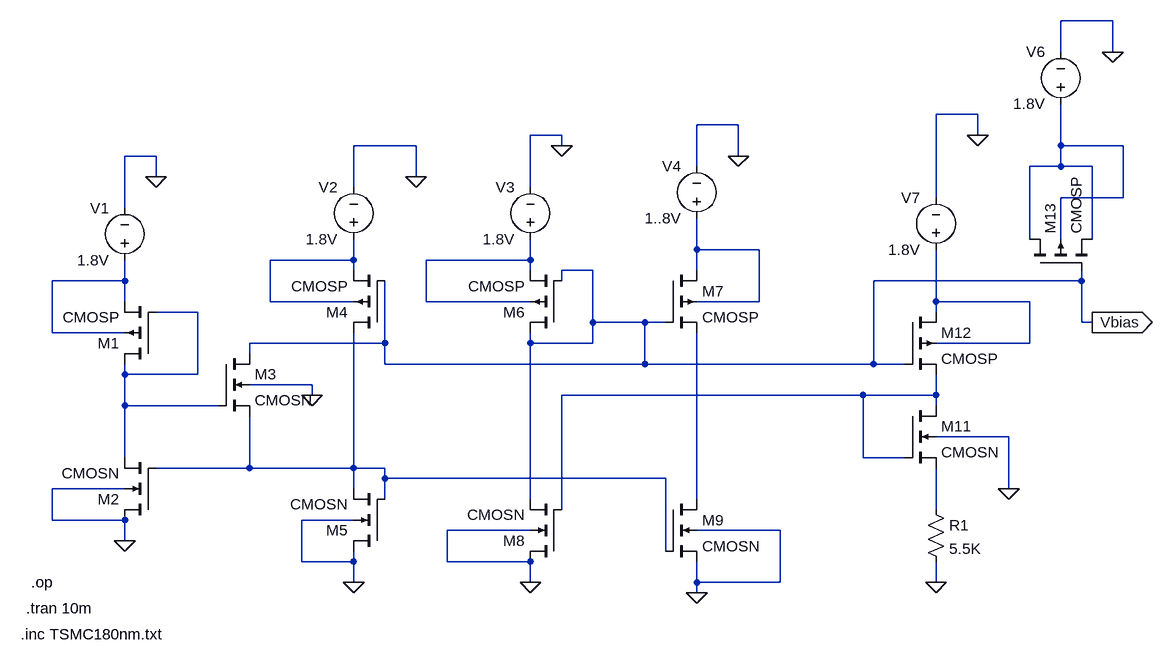
[diagram p0: schematic 1st.asc]
1st.asc, the LTspice schematic file:
Version 4
SHEET 1 1484 680
WIRE 1392 -416 1312 -416
WIRE 1312 -368 1312 -416
WIRE 1392 -368 1392 -416
WIRE 1184 -272 1120 -272
WIRE 816 -256 752 -256
WIRE 544 -240 496 -240
WIRE 1184 -240 1184 -272
WIRE 320 -224 224 -224
WIRE 544 -224 544 -240
WIRE 1312 -224 1312 -288
WIRE 1408 -224 1312 -224
WIRE -80 -208 -128 -208
WIRE 816 -208 816 -256
WIRE 752 -192 752 -256
WIRE 1312 -192 1312 -224
WIRE 1312 -192 1264 -192
WIRE 1360 -192 1312 -192
WIRE -80 -176 -80 -208
WIRE 320 -176 320 -224
WIRE 224 -160 224 -224
WIRE 496 -160 496 -240
WIRE 1120 -144 1120 -272
WIRE 1408 -144 1408 -224
WIRE 1408 -144 1312 -144
WIRE -128 -128 -128 -208
WIRE 1264 -80 1264 -192
WIRE 1312 -80 1312 -144
WIRE 1360 -80 1360 -192
WIRE 752 -64 752 -112
WIRE 848 -64 752 -64
WIRE 224 -48 224 -80
WIRE 224 -48 96 -48
WIRE 496 -48 496 -80
WIRE 496 -48 336 -48
WIRE 224 -32 224 -48
WIRE 496 -32 496 -48
WIRE 592 -32 544 -32
WIRE 752 -32 752 -64
WIRE -128 -16 -128 -48
WIRE -128 -16 -240 -16
WIRE 544 -16 544 -32
WIRE 1344 -16 1344 -32
WIRE 1344 -16 1024 -16
WIRE -128 16 -128 -16
WIRE 96 16 96 -48
WIRE 224 16 96 16
WIRE 336 16 336 -48
WIRE 496 16 336 16
WIRE 848 16 848 -64
WIRE 848 16 752 16
WIRE 1120 16 1120 -64
WIRE 1264 16 1120 16
WIRE -16 32 -80 32
WIRE 1120 32 1120 16
WIRE 592 48 592 -32
WIRE 672 48 592 48
WIRE 704 48 672 48
WIRE 1344 48 1344 -16
WIRE 1360 48 1344 48
WIRE -240 64 -240 -16
WIRE -128 64 -240 64
WIRE 272 80 272 -16
WIRE 272 80 64 80
WIRE 496 80 496 64
WIRE 592 80 592 48
WIRE 592 80 496 80
WIRE 1264 80 1264 16
WIRE 1264 80 1120 80
WIRE 64 96 64 80
WIRE 272 112 272 80
WIRE 672 112 672 48
WIRE 672 112 272 112
WIRE 1024 112 1024 -16
WIRE 1024 112 672 112
WIRE 1072 112 1024 112
WIRE -128 128 -128 112
WIRE -16 128 -16 32
WIRE -16 128 -128 128
WIRE 160 144 64 144
WIRE 160 160 160 144
WIRE 1008 160 544 160
WIRE 1120 160 1120 128
WIRE 1120 160 1008 160
WIRE -128 176 -128 128
WIRE 16 176 -128 176
WIRE 1120 176 1120 160
WIRE 1232 224 1120 224
WIRE -128 256 -128 176
WIRE 1008 256 1008 160
WIRE 1072 256 1008 256
WIRE 64 272 64 192
WIRE 64 272 -80 272
WIRE 224 272 224 64
WIRE 224 272 64 272
WIRE 272 272 224 272
WIRE 272 288 272 272
WIRE 704 288 272 288
WIRE -128 304 -240 304
WIRE 224 304 224 272
WIRE 1232 304 1232 224
WIRE 272 320 272 288
WIRE 496 320 496 80
WIRE 752 320 752 64
WIRE 544 336 544 160
WIRE 1120 336 1120 272
WIRE -240 352 -240 304
WIRE -128 352 -240 352
WIRE 224 352 144 352
WIRE 496 368 368 368
WIRE 880 368 752 368
WIRE -128 384 -128 352
WIRE 704 400 704 288
WIRE 144 416 144 352
WIRE 224 416 224 400
WIRE 224 416 144 416
WIRE 368 416 368 368
WIRE 496 416 368 416
WIRE 224 448 224 416
WIRE 496 448 496 416
WIRE 752 448 752 416
WIRE 880 448 880 368
WIRE 880 448 752 448
WIRE 1120 448 1120 416
WIRE 752 464 752 448
FLAG -80 -176 0
FLAG -128 384 0
FLAG 320 -176 0
FLAG 544 -224 0
FLAG 224 448 0
FLAG 496 448 0
FLAG 752 464 0
FLAG 1184 -240 0
FLAG 1392 -368 0
FLAG 1120 448 0
FLAG 816 -208 0
FLAG 1360 48 Vbias
IOPIN 1360 48 Out
FLAG 160 160 0
FLAG 1232 304 0
SYMBOL voltage -128 -32 R180
WINDOW 0 24 96 Left 2
WINDOW 3 24 16 Left 2
WINDOW 123 0 0 Left 0
WINDOW 39 0 0 Left 0
SYMATTR InstName V1
SYMATTR Value 1.8V
SYMBOL pmos4 -80 112 R180
SYMATTR InstName M1
SYMATTR Value2 l=1800n w=900n
SYMATTR Value CMOSP
SYMBOL nmos4 -80 352 R180
SYMATTR InstName M2
SYMATTR Value2 l=360n w=1800n
SYMATTR Value CMOSN
SYMBOL nmos4 16 96 R0
SYMATTR InstName M3
SYMATTR Value2 l=360n w=720n
SYMATTR Value CMOSN
SYMBOL pmos4 272 64 R180
SYMATTR InstName M4
SYMATTR Value2 l=360n w=4320n
SYMATTR Value CMOSP
SYMBOL voltage 224 -64 R180
WINDOW 0 24 96 Left 2
WINDOW 3 24 16 Left 2
WINDOW 123 0 0 Left 0
WINDOW 39 0 0 Left 0
SYMATTR InstName V2
SYMATTR Value 1.8V
SYMBOL nmos4 272 400 R180
SYMATTR InstName M5
SYMATTR Value2 l=360n w=1800n
SYMATTR Value CMOSN
SYMBOL pmos4 544 64 R180
SYMATTR InstName M6
SYMATTR Value2 l=360n w=4320n
SYMATTR Value CMOSP
SYMBOL pmos4 704 -32 R0
SYMATTR InstName M7
SYMATTR Value2 l=360n w=4320n
SYMATTR Value CMOSP
SYMBOL voltage 496 -64 R180
WINDOW 0 24 96 Left 2
WINDOW 3 24 16 Left 2
WINDOW 123 0 0 Left 0
WINDOW 39 0 0 Left 0
SYMATTR InstName V3
SYMATTR Value 1.8V
SYMBOL nmos4 544 416 R180
SYMATTR InstName M8
SYMATTR Value2 l=360n w=1800n
SYMATTR Value CMOSN
SYMBOL nmos4 704 320 R0
SYMATTR InstName M9
SYMATTR Value2 l=360n w=1800n
SYMATTR Value CMOSN
SYMBOL nmos4 1072 176 R0
SYMATTR InstName M11
SYMATTR Value2 l=360n w=5400n
SYMATTR Value CMOSN
SYMBOL pmos4 1072 32 R0
SYMATTR InstName M12
SYMATTR Value2 l=360n w=4320n
SYMATTR Value CMOSP
SYMBOL pmos4 1264 -32 R270
SYMATTR InstName M13
SYMATTR Value2 l=9000n w=9000n
SYMATTR Value CMOSP
SYMBOL voltage 1312 -272 R180
WINDOW 0 24 96 Left 2
WINDOW 3 24 16 Left 2
WINDOW 123 0 0 Left 0
WINDOW 39 0 0 Left 0
SYMATTR InstName V6
SYMATTR Value 1.8V
SYMBOL voltage 1120 -48 R180
WINDOW 0 24 96 Left 2
WINDOW 3 24 16 Left 2
WINDOW 123 0 0 Left 0
WINDOW 39 0 0 Left 0
SYMATTR InstName V7
SYMATTR Value 1.8V
SYMBOL res 1104 320 R0
SYMATTR InstName R1
SYMATTR Value 5.5K
SYMBOL voltage 752 -96 R180
WINDOW 0 24 96 Left 2
WINDOW 3 24 16 Left 2
WINDOW 123 0 0 Left 0
WINDOW 39 0 0 Left 0
SYMATTR InstName V4
SYMATTR Value 1..8V
TEXT -280 488 Left 2 !.tran 10m
TEXT -288 528 Left 2 !.inc TSMC180nm.txt
TEXT -272 448 Left 2 !.op

The netlist it stands for:
* 1st.asc
V1 N005 0 1.8V
M1 N007 N007 N005 N005 CMOSP l=1800n w=900n
M2 0 N009 N007 0 CMOSN l=360n w=1800n
M3 Vbias N007 N009 0 CMOSN l=360n w=720n
M4 N009 Vbias N003 N003 CMOSP l=360n w=4320n
V2 N003 0 1.8V
M5 0 N009 N009 0 CMOSN l=360n w=1800n
M6 Vbias Vbias N004 N004 CMOSP l=360n w=4320n
M7 N002 Vbias N010 N002 CMOSP l=360n w=4320n
V3 N004 0 1.8V
M8 0 N008 Vbias 0 CMOSN l=360n w=1800n
M9 N010 N009 0 0 CMOSN l=360n w=1800n
M11 N008 N008 N011 0 CMOSN l=360n w=5400n
M12 N006 Vbias N008 N006 CMOSP l=360n w=4320n
M13 N001 Vbias N001 N001 CMOSP l=9000n w=9000n
V6 N001 0 1.8V
V7 N006 0 1.8V
R1 N011 0 5.5K
V4 N002 0 1..8V
.model NMOS NMOS
.model PMOS PMOS
.lib standard.mos
.tran 10m
.inc TSMC180nm.txt
.op
.backanno
.end